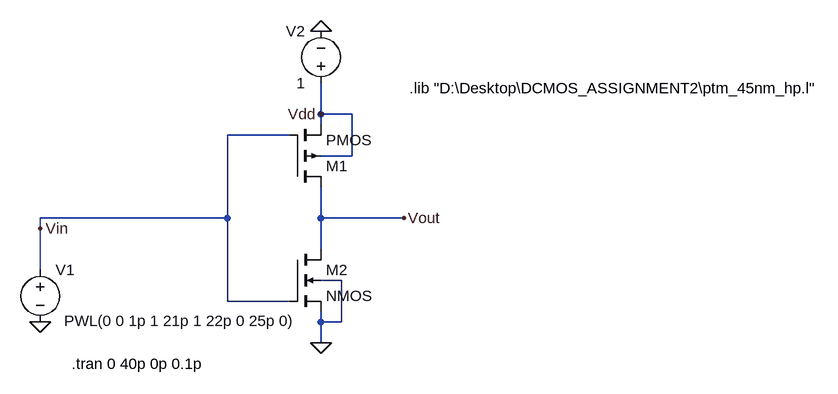
[diagram p0: schematic Q1.asc]
Q1.asc, the LTspice schematic file:
Version 4
SHEET 1 1108 680
WIRE 288 -16 288 -64
WIRE 336 -16 288 -16
WIRE 288 0 288 -16
WIRE 240 16 144 16
WIRE 336 48 336 -16
WIRE 336 48 288 48
WIRE 144 144 144 16
WIRE 144 144 -144 144
WIRE 288 144 288 96
WIRE 416 144 288 144
WIRE -144 160 -144 144
WIRE 288 192 288 144
WIRE -144 224 -144 160
WIRE 320 240 288 240
WIRE 144 272 144 144
WIRE 240 272 144 272
WIRE 288 304 288 288
WIRE 320 304 320 240
WIRE 320 304 288 304
WIRE 288 336 288 304
FLAG -144 304 0
FLAG 288 336 0
FLAG 288 -144 0
FLAG 416 144 Vout
FLAG -144 160 Vin
FLAG 288 -16 Vdd
SYMBOL voltage -144 208 R0
WINDOW 3 216 110 Bottom 2
WINDOW 123 0 0 Left 0
WINDOW 39 0 0 Left 0
SYMATTR Value PWL(0 0 1p 1 21p 1 22p 0 25p 0)
SYMATTR InstName V1
SYMBOL pmos4 240 96 M180
SYMATTR InstName M1
SYMATTR Value2 l=45nm w=180nm
SYMBOL nmos4 240 192 R0
SYMATTR InstName M2
SYMATTR Value2 l=45nm w=90nm
SYMBOL voltage 288 -48 R180
WINDOW 0 24 96 Left 2
WINDOW 3 24 16 Left 2
WINDOW 123 0 0 Left 0
WINDOW 39 0 0 Left 0
SYMATTR InstName V2
SYMATTR Value 1
TEXT -96 368 Left 2 !.tran 0 40p 0p 0.1p
TEXT 424 -56 Left 2 !.lib "D:\\Desktop\\DCMOS_ASSIGNMENT2\\ptm_45nm_hp.l"

The netlist it stands for:
* Q1.asc
V1 Vin 0 PWL(0 0 1p 1 21p 1 22p 0 25p 0)
M1 Vout Vin Vdd Vdd PMOS l=45nm w=180nm
M2 Vout Vin 0 0 NMOS l=45nm w=90nm
V2 Vdd 0 1
.model NMOS NMOS
.model PMOS PMOS
.lib standard.mos
.tran 0 40p 0p 0.1p
.lib "D:\Desktop\DCMOS_ASSIGNMENT2\ptm_45nm_hp.l"
.backanno
.end

* Results of the author's LTspice run, read from the files saved beside the schematic
* Operating Point, zero values left out:
*   V(vout) = 1 V
*   V(vdd) = 1 V
*   Id(M1) = -1.696 nA
*   Ig(M1) = -256.1 pA
*   Ib(M1) = 5.31 pA
*   Is(M1) = 1.946 nA
*   Id(M2) = 1.696 nA
*   Ig(M2) = -12.8 pA
*   Ib(M2) = -1.01 pA
*   Is(M2) = -1.682 nA
*   I(V1) = 268.9 pA
*   I(V2) = -1.952 nA
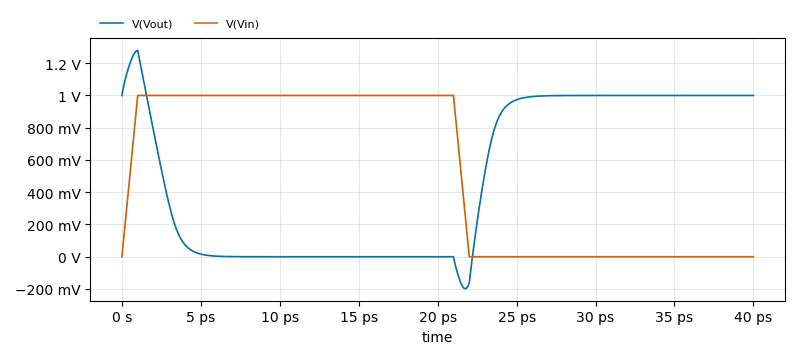
[diagram p1: Transient Analysis of Q1.asc, plotted from the saved traces]
* Transient Analysis, 1 run:
*   V(Vout): min -198.9 mV, max 1.28 V, average 492.5 mV, rms 695.4 mV, last 1 V
*   V(Vin): min 0 V, max 1 V, average 525 mV, rms 718.8 mV, last 0 V